# Altium project Controller.PrjPcb
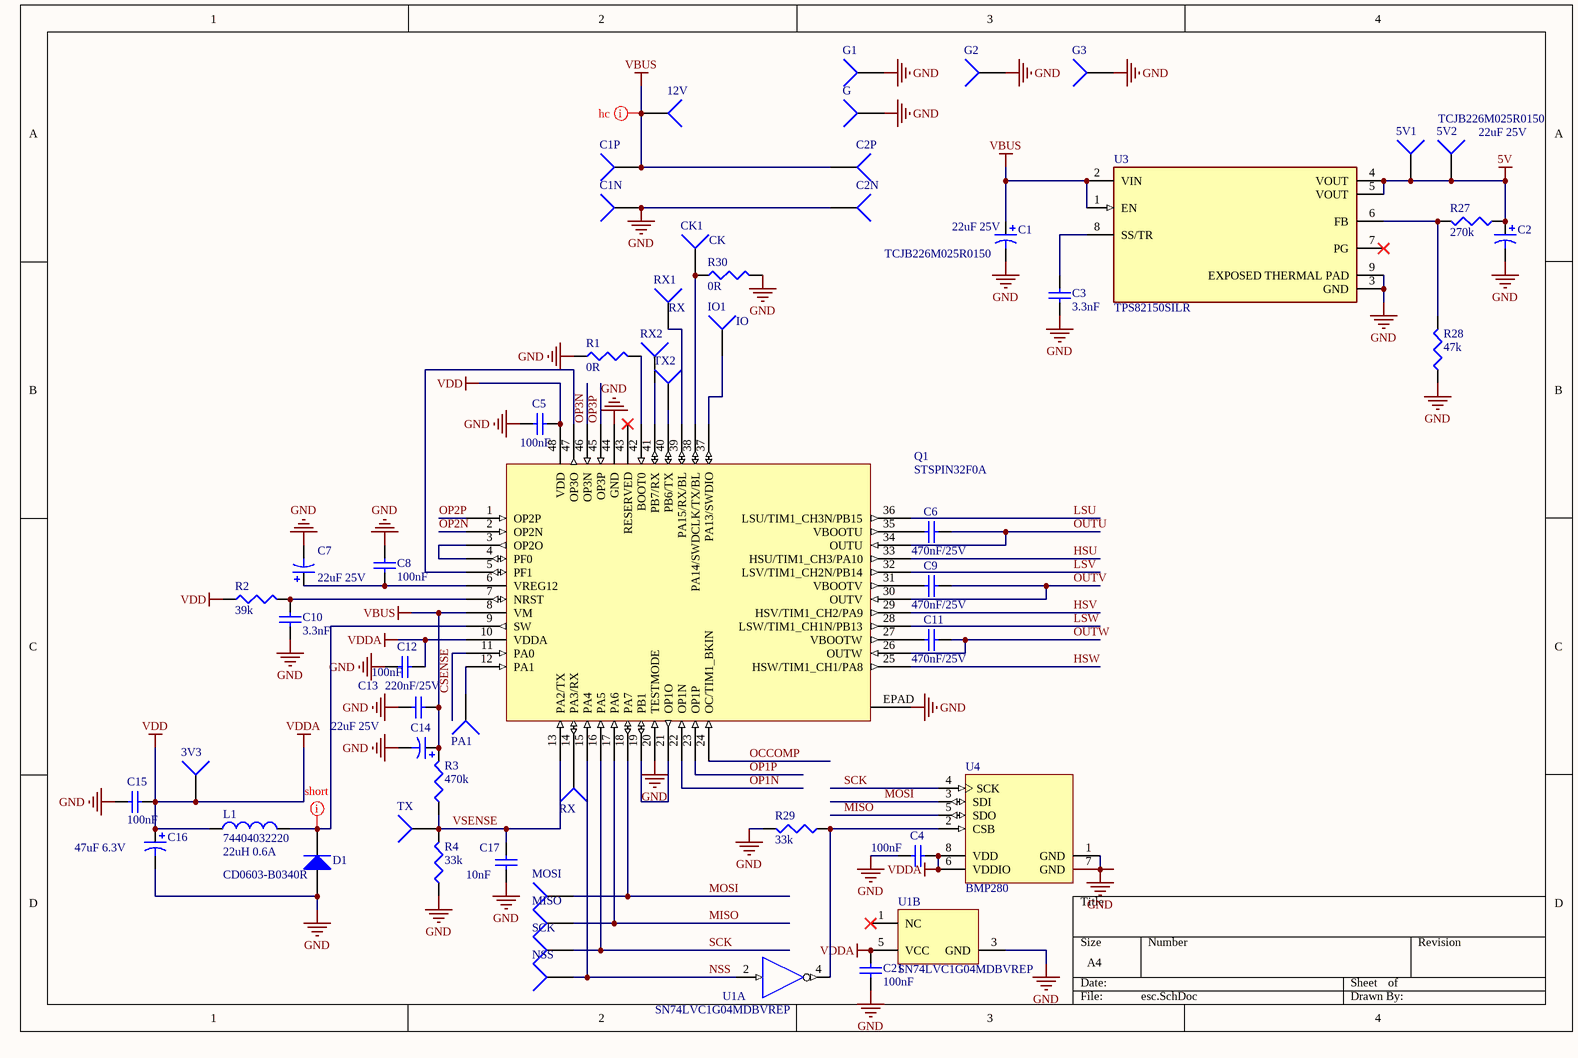
[diagram p0: esc.SchDoc]
2 sheets, 91 parts. Net scope: global (net labels, ports and power ports of the same name join across sheets).
Board file: Controller.PcbDoc
Sheets:
  esc.SchDoc
  drivers.SchDoc

## Sheet esc.SchDoc
size A4

### Parts
3V3  3V3  [large_pin]  (value not drawn)
5V1  5V1  [large_pin]  (value not drawn)
5V2  5V2  [large_pin]  (value not drawn)
12V  12V  [large_pin]  (value not drawn)
C1  TCJB226M025R0150  value 22uF 25V  [my_0805_pol]
C1N  C1N  [large_pin]  (value not drawn)
C1P  C1P  [large_pin]  (value not drawn)
C2  TCJB226M025R0150  value 22uF 25V  [my_0805_pol]
C2N  C2N  [large_pin]  (value not drawn)
C2P  C2P  [large_pin]  (value not drawn)
C3  3.3nF  [MY_0402]
C4  100nF  [MY_0402]
C5  100nF  [MY_0402]
C6  470nF/25V  [MY_0402]
C7  value 22uF 25V  [MY_0805_pol]
C8  100nF  [MY_0402]
C9  470nF/25V  [MY_0402]
C10  3.3nF  [MY_0402]
C11  470nF/25V  [MY_0402]
C12  100nF  [MY_0402]
C13  220nF/25V  [MY_0402]
C14  value 22uF 25V  [my_0805_pol]
C15  100nF  [MY_0402]
C16  value 47uF 6.3V  [my_1206_pol]
C17  10nF  [MY_0402]
C21  100nF  [MY_0402]
CK1  CK  [solder_pin_small]
D1  CD0603-B0340R  [my_0603]
G  G  [large_pin]  (value not drawn)
G1  G  [large_pin]  (value not drawn)
G2  G  [large_pin]  (value not drawn)
G3  G  [large_pin]  (value not drawn)
IO1  IO  [solder_pin_small]
L1  74404032220  value 22uH 0.6A  [IND_3_3]
MISO  MISO  [large_pin]  (value not drawn)
MOSI  MOSI  [large_pin]  (value not drawn)
NSS  NSS  [large_pin]  (value not drawn)
PA1  PA1  [large_pin]  (value not drawn)
Q1  STSPIN32F0A  [VFQFPN48]
R1  0R  [MY_0402]
R2  39k  [MY_0402]
R3  470k  [MY_0402]
R4  33k  [MY_0402]
R27  270k  [MY_0402]
R28  47k  [MY_0402]
R29  33k  [MY_0402]
R30  0R  [MY_0402]
RX  RX  [large_pin]  (value not drawn)
RX1  RX  [solder_pin_small]
RX2  PA1  [large_pin]  (value not drawn)
SCK  SCK  [large_pin]  (value not drawn)
TX  RX  [large_pin]  (value not drawn)
TX2  TX2  [large_pin]  (value not drawn)
U1  SN74LVC1G04MDBVREP  [DBV0005A_M]  (parts A,B of 2)
U3  TPS82150SILR  [FP-SIL0008D-MFG]
U4  BMP280  [BOSC-LGA-8_V]

### Nets
5V: 5V1.1 5V2.1 C2.1 R27.1 U3.4(VOUT) U3.5(VOUT)
GND: C1.2 C1N.1 C2.2 C2N.1 C3.1 C4.2 C5.1 C7.2 C8.1 C10.2 C12.2 C13.2 C14.2 C15.1 C16.2 C17.2 C21.2 D1.1(A) G.1 G1.1 G2.1 G3.1 Q1.20(TESTMODE) Q1.44(GND) Q1.EPAD R1.1 R4.1 R28.1 R29.2 R30.2 U1.3(GND) U3.3(GND) U3.9(EXPOSED_THERMAL_PAD) U4.1(GND) U4.7(GND)
VBUS: 12V.1 C1.1 C1P.1 C2P.1 C13.1 C14.1 Q1.8(VM) R3.2 U3.1(EN) U3.2(VIN)
VDD: 3V3.1 C4.1 C5.2 C12.1 C15.2 C16.1 C21.1 L1.1 Q1.10(VDDA) Q1.48(VDD) R2.1 U1.5(VCC) U4.6(VDDIO) U4.8(VDD)  [also labelled VDDA]
CSENSE: Q1.11(PA0)
HSU: Q1.33(HSU/TIM1_CH3/PA10)
HSV: Q1.29(HSV/TIM1_CH2/PA9)
HSW: Q1.25(HSW/TIM1_CH1/PA8)
LSU: Q1.36(LSU/TIM1_CH3N/PB15)
LSV: Q1.32(LSV/TIM1_CH2N/PB14)
LSW: Q1.28(LSW/TIM1_CH1N/PB13)
MISO: MISO.1 Q1.17(PA6) U4.5(SDO)
MOSI: MOSI.1 Q1.18(PA7) U4.3(SDI)
NSS: NSS.1 Q1.15(PA4) U1.2(A)
OCCOMP: Q1.24(OC/TIM1_BKIN)
OP1N: Q1.22(OP1N)
OP1P: Q1.1(OP2P) Q1.23(OP1P) Q1.45(OP3P)  [also labelled OP2P, OP3P]
OP2N: Q1.2(OP2N)
OP3N: Q1.46(OP3N)
OUTU: C6.2 Q1.34(OUTU)
OUTV: C9.2 Q1.30(OUTV)
OUTW: C11.2 Q1.26(OUTW)
SCK: Q1.16(PA5) SCK.1 U4.4(SCK)
VSENSE: C17.1 Q1.13(PA2/TX) R3.1 R4.2 TX.1
NetC3_2: C3.2 U3.8(SS/TR)
NetC6_1: C6.1 Q1.35(VBOOTU)
NetC7_1: C7.1 C8.2 Q1.6(VREG12)
NetC9_1: C9.1 Q1.31(VBOOTV)
NetC10_1: C10.1 Q1.7(NRST) R2.2
NetC11_1: C11.1 Q1.27(VBOOTW)
NetCK1_1: CK1.1 Q1.38(PA14/SWDCLK/TX/BL) R30.1
NetD1_2: D1.2(K) L1.2 Q1.9(SW)
NetIO1_1: IO1.1 Q1.37(PA13/SWDIO)
NetPA1_1: PA1.1 Q1.12(PA1)
NetQ1_3: Q1.3(OP2O) Q1.4(PF0)
NetQ1_5: Q1.5(PF1) Q1.47(OP3O)
NetQ1_14: Q1.14(PA3/RX) RX.1
NetQ1_19: Q1.19(PB1) Q1.21(OP1O)
NetQ1_39: Q1.39(PA15/RX/BL) RX1.1
NetQ1_40: Q1.40(PB6/TX) TX2.1
NetQ1_41: Q1.41(PB7/RX) RX2.1
NetQ1_42: Q1.42(BOOT0) R1.2
NetR27_2: R27.2 R28.2 U3.6(FB)
NetR29_1: R29.1 U1.4(Y) U4.2(CSB)

Not connected (* = marked no-connect by the designer): Q1 43(RESERVED)*; U1 1(NC)*; U3 7(PG)*

### Layout directives
net class short: NetD1_2
net class hc: VBUS

### Library data of the parts
3V3 5V1 5V2 12V C1N C1P C2N C2P CK1 G G1-G3 IO1 MISO MOSI NSS PA1 RX RX1 RX2 SCK TX TX2 = Socket: LatestRevisionDate: 17-Jul-2002; LatestRevisionNote: Re-released for DXP Platform.; Publisher: Altium Limited
C1 C2 C7 C14 C16 = Cap Pol3: Polarized Capacitor (Surface Mount); Published: 8-Jun-2000; LatestRevisionDate: 29-May-2009; LatestRevisionNote: IPC-7351 Footprint Added.; PackageReference: C0805; Publisher: Altium Limited; PackageDescription: Chip Capacitor
C3 C17 = Cap: Capacitor; Value: 4.7nF; Published: 8-Jun-2000; LatestRevisionDate: 17-Jul-2002; LatestRevisionNote: Re-released for DXP Platform.; PackageReference: RAD-0.3; Publisher: Altium Limited; PackageDescription: Radial Cap, Thru-Hole; 2 Leads; 0.3 in Pin Spacing
C4 C5 C8 C12 C15 C21 = Cap: Capacitor; Published: 8-Jun-2000; LatestRevisionDate: 17-Jul-2002; LatestRevisionNote: Re-released for DXP Platform.; PackageReference: RAD-0.3; Publisher: Altium Limited; PackageDescription: Radial Cap, Thru-Hole; 2 Leads; 0.3 in Pin Spacing; Value: 100nF
C6 C9 C11 = Cap: Capacitor; Value: 470nF; Published: 8-Jun-2000; LatestRevisionDate: 17-Jul-2002; LatestRevisionNote: Re-released for DXP Platform.; PackageReference: RAD-0.3; Publisher: Altium Limited; PackageDescription: Radial Cap, Thru-Hole; 2 Leads; 0.3 in Pin Spacing
C10 C13 = Cap: Capacitor; Value: 100nF; Published: 8-Jun-2000; LatestRevisionDate: 17-Jul-2002; LatestRevisionNote: Re-released for DXP Platform.; PackageReference: RAD-0.3; Publisher: Altium Limited; PackageDescription: Radial Cap, Thru-Hole; 2 Leads; 0.3 in Pin Spacing
D1 = Diode: Default Diode; Published: 8-Jun-2000; LatestRevisionDate: 17-Jul-2002; LatestRevisionNote: Re-released for DXP Platform.; PackageVersion: Sep-1996; PackageReference: SMC; Publisher: Altium Limited; PackageDescription: DO-214-AB/SMC; 2 C-Bend Leads; Body 7.9 x 5.9 mm, inc. leads (LxW); Code_JEDEC: DO-214-AB
L1 = Inductor: Code_IEC: 1005; Published: 8-Jun-2000; LatestRevisionDate: 29-May-2009; LatestRevisionNote: IPC-7351 Footprint Added.; PackageReference: 0402-A; Publisher: Altium Limited; PackageDescription: Chip Inductor; Code_JEITA: 0402
R1-R4 R27-R30 = Res3: Resistor; Value: 10K; Published: 8-Jun-2000; LatestRevisionDate: 29-May-2009; LatestRevisionNote: IPC-7351 Footprint Added.; PackageReference: J1-0603; Publisher: Altium Limited; PackageDescription: Chip Resistor
U1 = CMP-0859-00138-3: Enhanced Product Single Inverter Gate, DBV0005A, LARGE T&R; Manufacturer: Texas Instruments; Generic Part Number: SN74LVC1G04-EP; Bits(#): 1; Input Type: CMOS/TTL; Logic: Inverting; Schmitt Trigger: No; Output Drive (IOL/IOH)(Max)(mA): 32/-32; tpd @ Nom Voltage(Max)(ns): 13.9,8,5.7,4.5; Rating: HiRel Enhanced Product; Output Type: CMOS; Technology Family: LVC; Sub-Family: Inverting Buffer/Driver; ICC @ Nom Voltage(Max)(mA): 0.01; VCC(Min)(V): 1.65; VCC(Max)(V): 5.5; F @ Nom Voltage(Max)(Mhz): 150; Voltage(Nom)(V): 1.8,2.5,3.3,5; DatasheetVersion: SCES691A; 3-State Output: No; PackageReference: DBV0005A; Operating Temperature Range(C): -55 to 125
U3 = CMP-04918-000050-1: DC DC CONVERTER 0.9-6V; Manufacturer: Texas Instruments; Max Junction Temp: +110°C; Number Of Outputs: 1; Max Supply Voltage: 17V; Max Duty Cycle: 100%; Output Type: AdjustableProgrammable; Switching Frequency: 2MHz; Output Current: 1A; Switching Topology: Buck; Min Supply Voltage: 3V; Nominal Supply Current: 20uA; RoHS: TRUE; Category: IC; Output Voltage: 0.9-6V; Temperature Range Low: -40°C; Device Class L1: Integrated Circuits (ICs); Automotive: No; ComponentLink2URL: http://www.ti.com/lit/ds/symlink/tps82150.pdf; Package: SIL0008D; Manufacturer Part Number: TPS82150SILR; Temperature: -40°C to +125°C; Device Class L2: Power Management ICs; Lead Free: Yes; ComponentLink2Description: Datasheet; Device Class L3: Voltage Regulators - Switching; Octopart: https://octopart.com/tps82150silr-texas+instruments-83003514; Temperature Range High: +125°C; Height: 1.53mm; Digikey Description: DC DC CONVERTER 0.9-6V
U4 = CMP-2000-05076-1: Digital Pressure Sensor, 1.71 to 3.6 V, -40 to 85 degC, 8-Pin LGA, RoHS, Tape and Reel; Manufacturer: Bosch Sensortec; Manufacturer URL: http://www.bosch-sensortec.com; Datasheet URL: http://datasheet.octopart.com/BMP280-Bosch-datasheet-41546027.pdf; Datasheet Version: Rev. 1.14, 05/2015

## Sheet drivers.SchDoc
size A
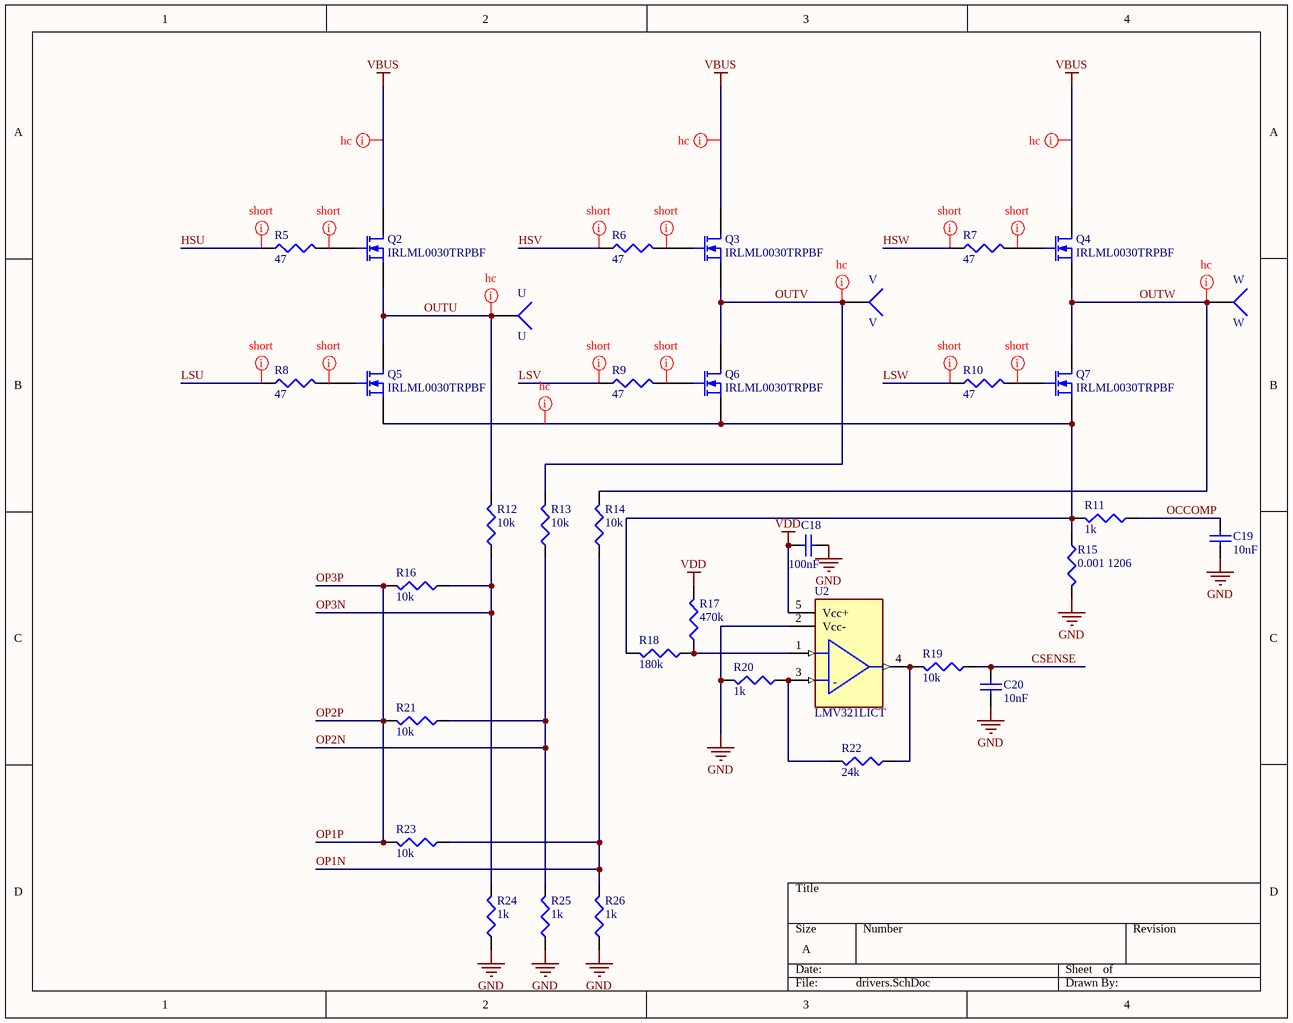
[diagram p1: drivers.SchDoc]

### Parts
C18  100nF  [MY_0402]
C19  10nF  [MY_0402]
C20  10nF  [MY_0402]
Q2  IRLML0030TRPBF  [Micro3]
Q3  IRLML0030TRPBF  [Micro3]
Q4  IRLML0030TRPBF  [Micro3]
Q5  IRLML0030TRPBF  [Micro3]
Q6  IRLML0030TRPBF  [Micro3]
Q7  IRLML0030TRPBF  [Micro3]
R5  47  [MY_0402]
R6  47  [MY_0402]
R7  47  [MY_0402]
R8  47  [MY_0402]
R9  47  [MY_0402]
R10  47  [MY_0402]
R11  1k  [MY_0402]
R12  10k  [MY_0402]
R13  10k  [MY_0402]
R14  10k  [MY_0402]
R15  0.001 1206  [MY_1206]
R16  10k  [MY_0402]
R17  470k  [MY_0402]
R18  180k  [MY_0402]
R19  10k  [MY_0402]
R20  1k  [MY_0402]
R21  10k  [MY_0402]
R22  24k  [MY_0402]
R23  10k  [MY_0402]
R24  1k  [MY_0402]
R25  1k  [MY_0402]
R26  1k  [MY_0402]
U  U  [solder_pin_small]
U2  LMV321LICT  [FP-SOT323-5-IPC_C]
V  V  [solder_pin_small]
W  W  [solder_pin_small]

### Nets
GND: C18.2 C19.1 C20.1 R15.2 R20.2 R24.1 R25.1 R26.1 U2.2(Vcc-)
VBUS: Q2.D Q3.D Q4.D
VDD: C18.1 R17.2 U2.5(Vcc+)
CSENSE: C20.2 R19.1
HSU: R5.1
HSV: R6.1
HSW: R7.1
LSU: R8.1
LSV: R9.1
LSW: R10.1
OCCOMP: C19.2 R11.1
OP1N: R14.1 R23.1 R26.2
OP1P: R16.2 R21.2 R23.2  [also labelled OP2P, OP3P]
OP2N: R13.1 R21.1 R25.2
OP3N: R12.1 R16.1 R24.2
OUTU: Q2.S Q5.D R12.2 U.1
OUTV: Q3.S Q6.D R13.2 V.1
OUTW: Q4.S Q7.D R14.2 W.1
NetQ2_G: Q2.G R5.2
NetQ3_G: Q3.G R6.2
NetQ4_G: Q4.G R7.2
NetQ5_G: Q5.G R8.2
NetQ5_S: Q5.S Q6.S Q7.S R11.2 R15.1 R18.2
NetQ6_G: Q6.G R9.2
NetQ7_G: Q7.G R10.2
NetR17_1: R17.1 R18.1 U2.1(In+)
NetR19_2: R19.2 R22.1 U2.4(Out)
NetR20_1: R20.1 R22.2 U2.3(In-)

### Layout directives
net class short: HSU, HSV, HSW, LSU, LSV, LSW, NetQ2_G, NetQ3_G, NetQ4_G, NetQ5_G, NetQ6_G, NetQ7_G
net class hc: NetQ5_S, OUTU, OUTV, OUTW, VBUS

### Notes on the sheet
- (in symbol CMP-12131-000006-1) -

### Library data of the parts
C18-C20 = Cap: Capacitor; Published: 8-Jun-2000; LatestRevisionDate: 17-Jul-2002; LatestRevisionNote: Re-released for DXP Platform.; PackageReference: RAD-0.3; Publisher: Altium Limited; PackageDescription: Radial Cap, Thru-Hole; 2 Leads; 0.3 in Pin Spacing
  C18: Value: 100nF
  C19 C20: Value: 10nF
Q2-Q7 = MOSFET-N: N-Channel MOSFET; Published: 8-Jun-2000; LatestRevisionDate: 17-Jul-2002; LatestRevisionNote: Re-released for DXP Platform.; PackageVersion: 1995/1996; PackageReference: E3; Publisher: Altium Limited; PackageDescription: TO, Flat Index; 3 In-Line, Axial Leads; Body Dia. 4.6mm; Lead Dia. 0.5 mm (max)
R5-R26 = Res3: Resistor; Value: 50; Published: 8-Jun-2000; LatestRevisionDate: 29-May-2009; LatestRevisionNote: IPC-7351 Footprint Added.; PackageReference: J1-0603; Publisher: Altium Limited; PackageDescription: Chip Resistor
U V W = Socket: LatestRevisionDate: 17-Jul-2002; LatestRevisionNote: Re-released for DXP Platform.; Publisher: Altium Limited
U2 = CMP-12131-000006-1: IC OPAMP GP 1 CIRCUIT SC70-5; Manufacturer: STMicroelectronics; Input Bias Current: 0.027uA; Min Supply Voltage: 2.7V; Output Current Per Channel: 43mA; Voltage Gain: 100dB; Max Junction Temp: +150°C; Nominal Supply Current: 120-130uA; Number Of Channels: 1; Input Offset Voltage: 1mV; Gain Bandwidth: 1.3MHz; Max Supply Voltage: 5.5V; ComponentLink2URL: https://www.st.com/resource/en/datasheet/lmv321l.pdf; Digikey Description: IC OPAMP GP 1 CIRCUIT SC70-5; ComponentLink2Description: Datasheet; Package: SOT323-5; Temperature Range High: +125°C; Automotive: No; Ambient Temperature Range Low: -40°C; Category: IC; Device Class L2: Linear ICs; Mouser Description: Operational Amplifiers - Op Amps 1.3MHz LP Gen Op-Amp 250uA at 5V 7mV 25c; Octopart: https://octopart.com/lmv321lict-stmicroelectronics-23014003; Height: 1.1mm; Ambient Temperature Range High: +125°C; Ipc Land Pattern Name: SOT65P210X95-5; Device Class L1: Integrated Circuits (ICs); Temperature: -40°C to +125°C; Manufacturer Part Number: LMV321LICT; Device Class L3: Amplifiers - Op Amps; RoHS: TRUE; Temperature Range Low: -40°C; Lead Free: Yes

## Nets that join several sheets
GND: esc (35 pins), drivers (9 pins)
VBUS: esc (10 pins), drivers (Q2.D Q3.D Q4.D)
VDD: esc (14 pins), drivers (C18.1 R17.2 U2.5)
CSENSE: esc (Q1.11), drivers (C20.2 R19.1)
HSU: esc (Q1.33), drivers (R5.1)
HSV: esc (Q1.29), drivers (R6.1)
HSW: esc (Q1.25), drivers (R7.1)
LSU: esc (Q1.36), drivers (R8.1)
LSV: esc (Q1.32), drivers (R9.1)
LSW: esc (Q1.28), drivers (R10.1)
OCCOMP: esc (Q1.24), drivers (C19.2 R11.1)
OP1N: esc (Q1.22), drivers (R14.1 R23.1 R26.2)
OP1P: esc (Q1.1 Q1.23 Q1.45), drivers (R16.2 R21.2 R23.2)
OP2N: esc (Q1.2), drivers (R13.1 R21.1 R25.2)
OP3N: esc (Q1.46), drivers (R12.1 R16.1 R24.2)
OUTU: esc (C6.2 Q1.34), drivers (Q2.S Q5.D R12.2 U.1)
OUTV: esc (C9.2 Q1.30), drivers (Q3.S Q6.D R13.2 V.1)
OUTW: esc (C11.2 Q1.26), drivers (Q4.S Q7.D R14.2 W.1)